# Altium project VTG-Ctrl.PrjPcb
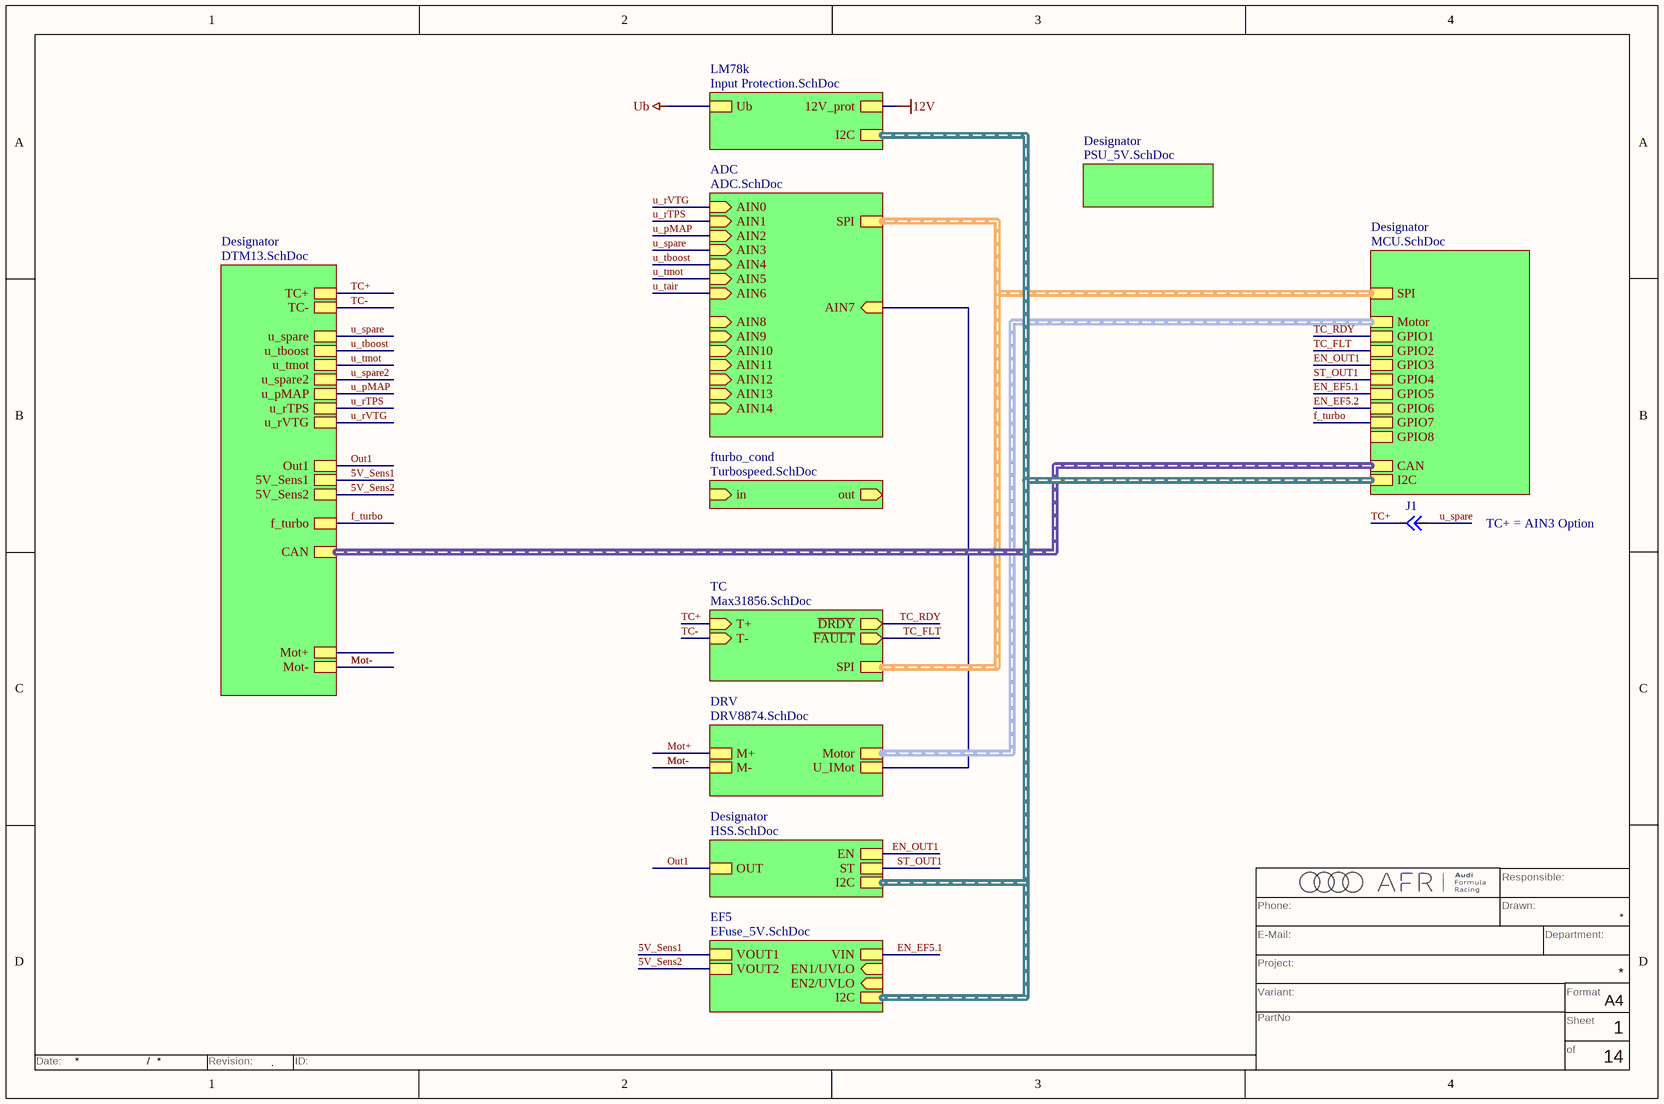
[diagram p0: VTG-Ctrl.SchDoc]
13 sheets, 162 parts. Net scope: hierarchical (ports join the sheet entries above them; power ports are global).
Board file: VTG-Ctrl.PcbDoc
Sheets:
  VTG-Ctrl.SchDoc
    Designator = MCU.SchDoc
    TC = Max31856.SchDoc
    DRV = DRV8874.SchDoc
    ADC = ADC.SchDoc
      LPF0 = LPF.SchDoc
      LPF1 = LPF.SchDoc
      LPF2 = LPF.SchDoc
      LPF3 = LPF.SchDoc
      LPF4 = LPF.SchDoc
      LPF5 = LPF.SchDoc
      LPF6 = LPF.SchDoc
      LPF7 = LPF.SchDoc
      LPF8 = LPF.SchDoc
      LPF9 = LPF.SchDoc
      LPF10 = LPF.SchDoc
      LPF11 = LPF.SchDoc
      LPF12 = LPF.SchDoc
      LPF13 = LPF.SchDoc
      LPF14 = LPF.SchDoc
    EF5 = EFuse_5V.SchDoc
    LM78k = Input Protection.SchDoc
    Designator = PSU_5V.SchDoc
    Designator = HSS.SchDoc
    Designator = DTM13.SchDoc
    fturbo_cond = Turbospeed.SchDoc
  EFuse_12V.SchDoc

## Sheet VTG-Ctrl.SchDoc
size A4; Author: Auth. Name; CompanyName: Audi Formula Racing GmbH; Organization: Audi Formula Racing GmbH; Address1: Heinrichsheimstr. 200; Address2: D-86633 Neuburg a.d. Donau; SheetNumber: 1; SheetTotal: 14

### Parts
J1  JUMPER  [JUMPER]  (value not drawn)

### Sub-sheets
ADC = ADC.SchDoc: AIN0 (in), AIN1 (in), AIN2 (in), AIN3 (in), AIN4 (in), AIN5 (in), AIN6 (in), AIN7 (in), SPI (harness SPI), AIN8 (in), AIN9 (in), AIN10 (in), AIN11 (in), AIN12 (in), AIN13 (in), AIN14 (in)
Designator = MCU.SchDoc: SPI (harness SPI), Motor (harness MotCtrl), GPIO1, GPIO2, GPIO3, GPIO4, GPIO5, CAN (harness CAN), GPIO6, GPIO7, GPIO8, I2C (harness I2C)
Designator = PSU_5V.SchDoc: no entries
Designator = HSS.SchDoc: ST, EN, OUT, I2C (harness I2C)
Designator = DTM13.SchDoc: TC+, TC-, u_spare, u_tboost, u_tmot, u_spare2, Out1, u_pMAP, u_rTPS, 5V_Sens1, 5V_Sens2, f_turbo, u_rVTG, Mot+, Mot-, CAN (harness CAN)
DRV = DRV8874.SchDoc: Motor (harness MotCtrl), U_IMot, M+, M-
EF5 = EFuse_5V.SchDoc: VIN, VOUT1, EN1/UVLO (in), EN2/UVLO (in), VOUT2, I2C (harness I2C)
fturbo_cond = Turbospeed.SchDoc: in (in), out (out)
LM78k = Input Protection.SchDoc: Ub, 12V_prot, I2C (harness I2C)
TC = Max31856.SchDoc: T- (in), T+ (in), ~{DRDY} (out), ~{FAULT} (out), SPI (harness SPI)

### Nets
5V_Sens1: sheet EF5/VOUT1, sheet Designator/5V_Sens1
5V_Sens2: sheet EF5/VOUT2, sheet Designator/5V_Sens2
AIN7: sheet DRV/U_IMot, sheet ADC/AIN7
EN_EF5.1: sheet Designator/GPIO5, sheet EF5/VIN
EN_EF5.2: sheet Designator/GPIO6
EN_OUT1: sheet Designator/GPIO3, sheet Designator/EN
f_turbo: sheet Designator/GPIO7, sheet Designator/f_turbo
Mot-: sheet DRV/M-, sheet Designator/Mot-
Out1: sheet Designator/OUT, sheet Designator/Out1
ST_OUT1: sheet Designator/GPIO4, sheet Designator/ST
TC+: J1.1 ; sheet TC/T+, sheet Designator/TC+
TC-: sheet TC/T-, sheet Designator/TC-
TC_FLT: sheet Designator/GPIO2, sheet TC/~{FAULT}
TC_RDY: sheet Designator/GPIO1, sheet TC/~{DRDY}
u_pMAP: sheet ADC/AIN2, sheet Designator/u_pMAP
u_rTPS: sheet ADC/AIN1, sheet Designator/u_rTPS
u_rVTG: sheet ADC/AIN0, sheet Designator/u_rVTG
u_spare: J1.2 ; sheet ADC/AIN3, sheet Designator/u_spare
u_spare2: sheet Designator/u_spare2
u_tboost: sheet ADC/AIN4, sheet Designator/u_tboost
u_tmot: sheet ADC/AIN5, sheet Designator/u_tmot

### Buses and harness runs
harness sheet ADC/SPI = sheet Designator/SPI = sheet TC/SPI
harness sheet Designator/I2C = sheet EF5/I2C = sheet LM78k/I2C
harness sheet Designator/Motor = sheet DRV/Motor

### Notes on the sheet
- TC+ = AIN3 Option
- Phone:
- Responsible:
- Drawn:
- Variant:
- Project:
- E-Mail:
- Department:
- Format
- PartNo
- of
- Sheet
- A4
- Date:
- /
- Revision:
- .
- ID:

### Library data of the parts
J1 = CMP-009-00061-4: Pins: 2

## Sheet MCU.SchDoc
size A4; SheetNumber: 2; SheetTotal: 14
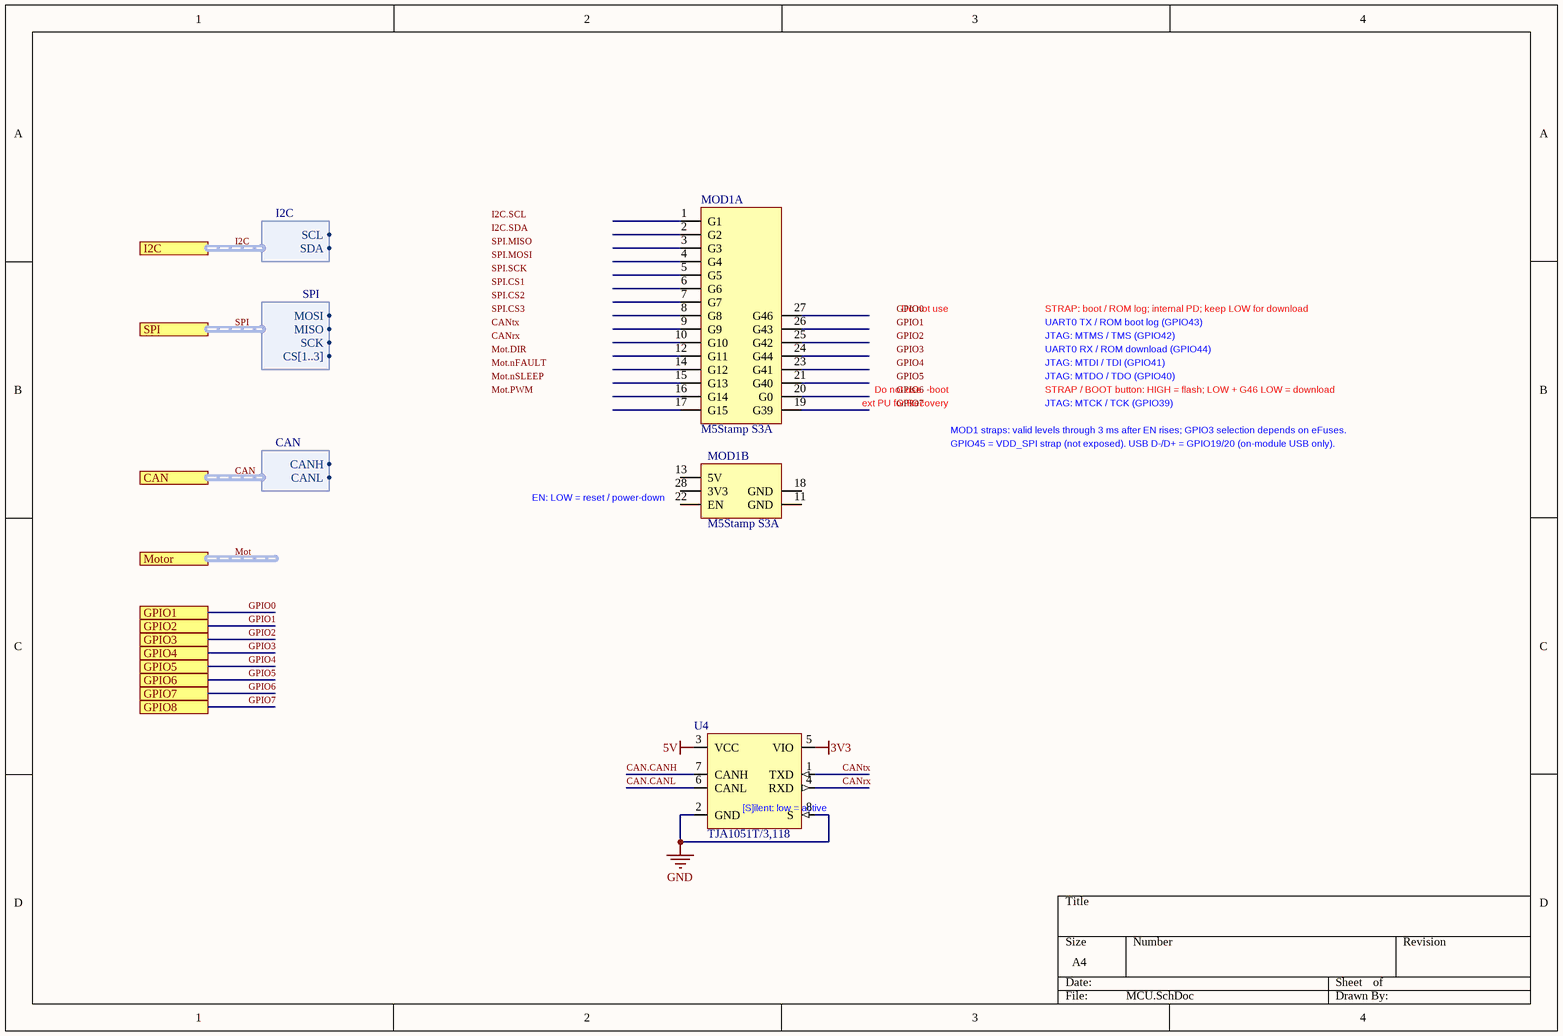
[diagram p1: MCU.SchDoc]

### Parts
MOD1  M5Stamp S3A  [M5Stamp S3A-mfg]  (parts A,B of 2)
U4  TJA1051T/3,118  [NXP-SOIC-8_L]

### Ports
CAN (harness CAN), GPIO1, GPIO2, GPIO3, GPIO4, GPIO5, GPIO6, GPIO7, GPIO8, I2C (harness I2C), Motor (harness MotCtrl), SPI (harness SPI)

### Harnesses
SPI: MOSI, MISO, SCK, CS[1..3]
CAN: CANH, CANL
I2C: SCL, SDA

### Nets
3V3: U4.5(VIO)
5V: U4.3(VCC)
GND: U4.2(GND) U4.8(S)
CAN.CANH: U4.7(CANH)
CAN.CANL: U4.6(CANL)
CANrx: U4.4(RXD)
CANtx: U4.1(TXD)
GPIO5: port GPIO6  [project net EN_EF5.2]
GPIO7: port GPIO8

Not connected (* = marked no-connect by the designer): MOD1 1(G1) 2(G2) 3(G3) 4(G4) 5(G5) 6(G6) 7(G7) 8(G8) 9(G9) 10(G10) 11(GND) 12(G11) 13(5V) 14(G12) 15(G13) 16(G14) 17(G15) 18(GND) 19(G39) 20(G0) 21(G40) 22(EN) 23(G41) 24(G44) 25(G42) 26(G43) 27(G46) 28(3V3)

### Buses and harness runs
harness CAN = port CAN
harness I2C = port I2C
harness Mot = port Motor
harness SPI = port SPI

### Notes on the sheet
- Do not use
- STRAP: boot / ROM log; internal PD; keep LOW for download
- JTAG: MTDO / TDO (GPIO40)
- JTAG: MTDI / TDI (GPIO41)
- JTAG: MTMS / TMS (GPIO42)
- UART0 RX / ROM download (GPIO44)
- UART0 TX / ROM boot log (GPIO43)
- Do not use  -boot
- ext PU for Recovery
- MOD1 straps: valid levels through 3 ms after EN rises; GPIO3 selection depends on eFuses.
- GPIO45 = VDD_SPI strap (not exposed). USB D-/D+ = GPIO19/20 (on-module USB only).
- STRAP / BOOT button: HIGH = flash; LOW + G46 LOW = download
- JTAG: MTCK / TCK (GPIO39)
- (near MOD1) EN: LOW = reset / power-down
- (near U4) [S]ilent: low = active
- Labels drawn without touching a wire or pin: CANrx, CANtx, GPIO0, GPIO1, GPIO2, GPIO3, GPIO4, GPIO5, GPIO6, GPIO7, I2C.SCL, I2C.SDA, Mot.DIR, Mot.nFAULT, Mot.nSLEEP, Mot.PWM, SPI.CS1, SPI.CS2, SPI.CS3, SPI.MISO, SPI.MOSI, SPI.SCK

### Library data of the parts
MOD1 = CMP-00060AA.R2: ESP32-S3FN8, 8MB Flash, RGB LED; Processor: ESP32-S3FN8; ComponentLink1Description: Product Page; ComponentLink1URL: https://docs.m5stack.com/en/core/Stamp-S3A
U4 = CMP-031-00023-A02: Interface Circuit, 1-Trnsvr, PDSO8; Data Rate: 1000Mbps; Number of Transceivers: 1; Power Supplies: 5V; Qualification Status: Not Qualified; Max Supply Current: 70uA; Package Body Material: Plastic; Telecom IC Type: CAN TRANSCEIVER; Package Equivalence Code: SOP8,.25; Reach SVHC Compliant: Yes; Width: 3.9mm; Terminal Position: DUAL; Channels: 1; Temperature Grade: AUTOMOTIVE; JESD-30 Code: R-PDSO-G8; Moisture Sensitivity Level: 1; Max Operating Temperature: 125°C; Terminal Pitch: 1.27mm; Case/Package: SOP; Terminal Form: Gull Wing; Pins: 8; Min Operating Temperature: -40°C; Terminal Finish: Nickel; Height - Seated (Max): 1.75mm; Package Style: SMALL OUTLINEMeter; Nominal Supply Voltage: 5V; RoHS Compliant: Yes; Surface Mount: Yes; Package Shape: Rectangular; JESD-609 Code: e4; Length: 4.9mm

## Sheet Max31856.SchDoc
size A4; SheetNumber: 3; SheetTotal: 7
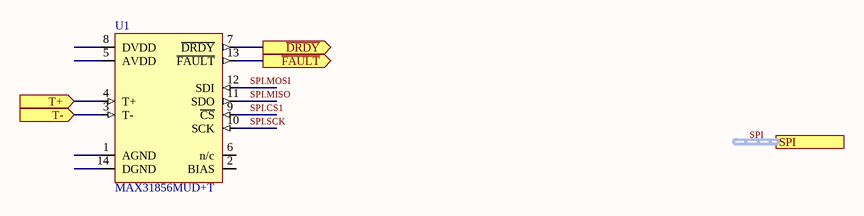
[diagram p2: Max31856.SchDoc]

### Parts
U1  MAX31856MUD+T  [TSSOP - 14]

### Ports
SPI (harness SPI), T+ (in), T- (in), ~{DRDY} (out), ~{FAULT} (out)

### Nets
SPI.CS1: U1.9(~{CS})
SPI.MISO: U1.11(SDO)
SPI.MOSI: U1.12(SDI)
SPI.SCK: U1.10(SCK)
TC+: U1.4(T+) ; port T+
TC-: U1.3(T-) ; port T-
TC_FLT: U1.13(~{FAULT}) ; port ~{FAULT}
TC_RDY: U1.7(~{DRDY}) ; port ~{DRDY}

Not connected (* = marked no-connect by the designer): U1 1(AGND) 2(BIAS) 5(AVDD) 6(n/c) 8(DVDD) 14(DGND)

### Buses and harness runs
harness SPI = port SPI

### Library data of the parts
U1 = CMP-015-00035-A01: Sensor Interface Precision Thermocouple to Digital Converter with Linearization; Samples Frequency: 10Hz; Sample Resolution: 19; Interface: SPI; Signal Type: Differential; Supply Voltage (Max): 3.6V; Supply Voltage (Min): 3.3V; Operating Temperature (Max): 125°C; Mounting Technology: Surface Mount; Pins: 14; RoHS Compliant: Yes; Operating Temperature (Min): -55°C; Case/Package: TSSOP

## Sheet DRV8874.SchDoc
size A4; SheetNumber: 4; SheetTotal: 7
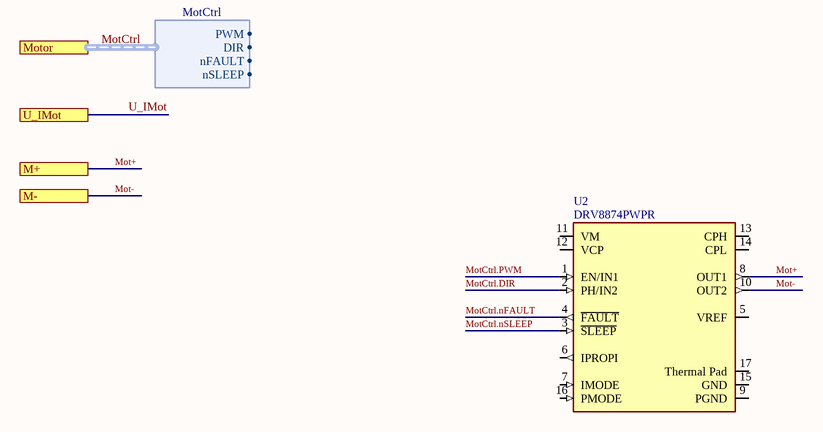
[diagram p3: DRV8874.SchDoc]

### Parts
U2  DRV8874PWPR  [FP-PWP0016J-MFG]

### Ports
M+, M-, Motor (harness MotCtrl), U_IMot

### Harnesses
MotCtrl: PWM, DIR, nFAULT, nSLEEP

### Nets
Mot+: U2.8(OUT1) ; port M+
Mot-: U2.10(OUT2) ; port M-
MotCtrl.DIR: U2.2(PH/IN2)
MotCtrl.nFAULT: U2.4(~{FAULT})
MotCtrl.nSLEEP: U2.3(~{SLEEP})
MotCtrl.PWM: U2.1(EN/IN1)

Not connected (* = marked no-connect by the designer): U2 5(VREF) 6(IPROPI) 7(IMODE) 9(PGND) 11(VM) 12(VCP) 13(CPH) 14(CPL) 15(GND) 16(PMODE) 17(Thermal_Pad)

### Buses and harness runs
harness MotCtrl = port Motor

### Library data of the parts
U2 = CMP-00024-00019-A02: 40-V, 6-A H-bridge motor driver with integrated current sensing feedback 16-HTSSOP -40 to 125; Sink Current (Max): -6A; Working Voltage: 5V; Supply Voltage (Max): 37V; Supply Voltage (Min): 4.5V; Source Current (Max): 6A; Operating Temperature (Max): 125°C; Pins: 16; Mounting Technology: SMT; Operating Temperature (Min): -40°C; RoHS Compliant: 16; Case/Package: HTSSOP16

## Sheet ADC.SchDoc
size A4; SheetNumber: 5; SheetTotal: 14
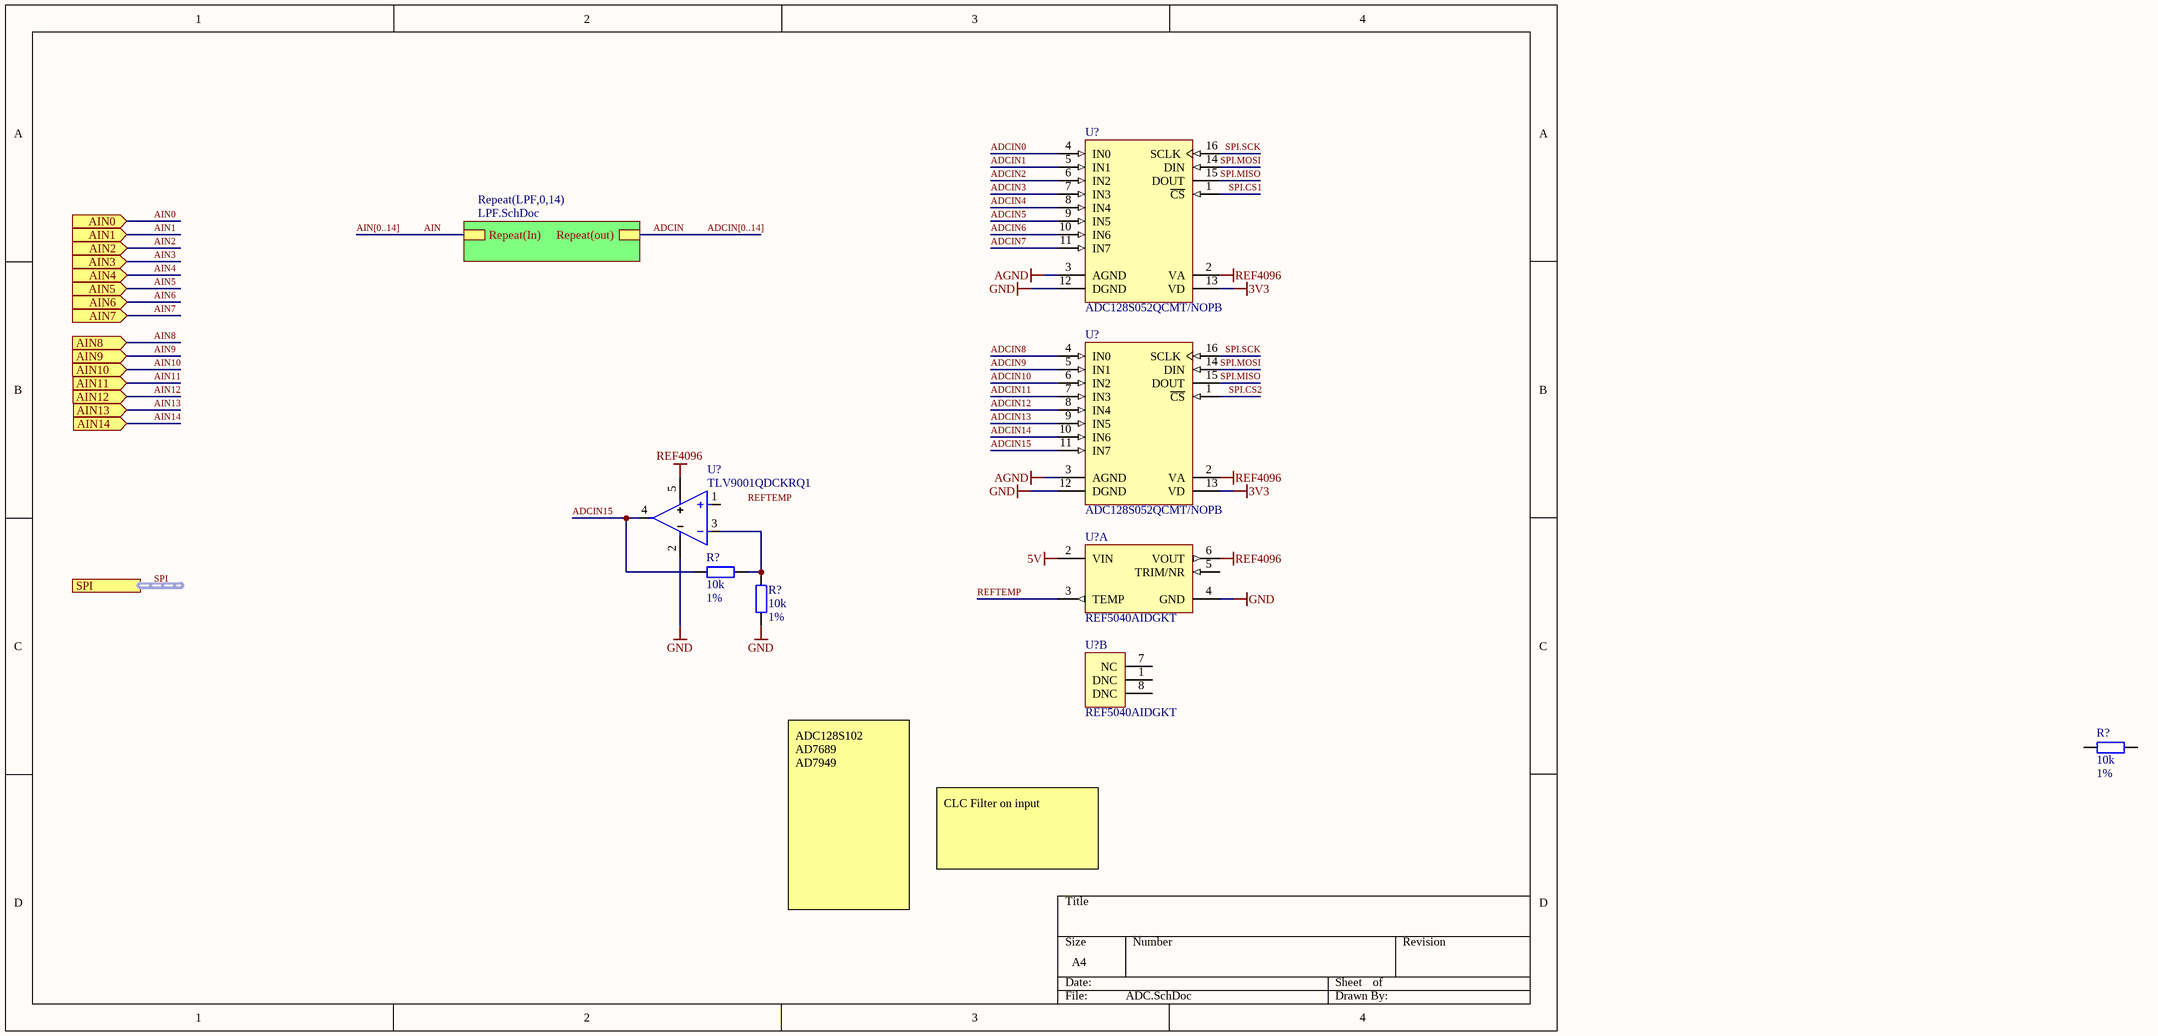
[diagram p4: ADC.SchDoc]

### Parts
(Parts that share a designator on the sheet are numbered #1, #2 ... from top to bottom, then left to right.)
R?#1  value 10k  Tolerance: 1%  [SMD_0603_RES]  (hidden comment: ERJ-3EKF1002V)
R?#2  value 10k  Tolerance: 1%  [SMD_0603_RES]  (hidden comment: ERJ-3EKF1002V)
R?#3  value 10k  Tolerance: 1%  [SMD_0603_RES]  (hidden comment: ERJ-3EKF1002V)
U?#1  ADC128S052QCMT/NOPB  [TI-PW16_L]
U?#2  ADC128S052QCMT/NOPB  [TI-PW16_L]
U?#3  TLV9001QDCKRQ1  [FP-DCK0005A-MFG]
U?#4  REF5040AIDGKT  [DGK0008A_N]  (part A of 2)
U?#5  REF5040AIDGKT  [DGK0008A_N]  (part B of 2)

### Sub-sheets
Repeat(LPF,0,14) = LPF.SchDoc: Repeat(In), Repeat(out)

### Ports
AIN0 (in), AIN1 (in), AIN2 (in), AIN3 (in), AIN4 (in), AIN5 (in), AIN6 (in), AIN7 (in), AIN8 (in), AIN9 (in), AIN10 (in), AIN11 (in), AIN12 (in), AIN13 (in), AIN14 (in), SPI (harness SPI)

### Nets
3V3: U?#1.13(VD) U?#2.13(VD)
5V: U?#4.2(VIN)
AGND: U?#1.3(AGND) U?#2.3(AGND)
GND: R?#2.1 U?#1.12(DGND) U?#2.12(DGND) U?#3.2(V-) U?#4.4(GND)
REF4096: U?#1.2(VA) U?#2.2(VA) U?#3.5(V+) U?#4.6(VOUT)
ADCIN: sheet Repeat(LPF,0,14)/Repeat(out)
ADCIN0: U?#1.4(IN0)
ADCIN1: U?#1.5(IN1)
ADCIN2: U?#1.6(IN2)
ADCIN3: U?#1.7(IN3)
ADCIN4: U?#1.8(IN4)
ADCIN5: U?#1.9(IN5)
ADCIN6: U?#1.10(IN6)
ADCIN7: U?#1.11(IN7)
ADCIN8: U?#2.4(IN0)
ADCIN9: U?#2.5(IN1)
ADCIN10: U?#2.6(IN2)
ADCIN11: U?#2.7(IN3)
ADCIN12: U?#2.8(IN4)
ADCIN13: U?#2.9(IN5)
ADCIN14: U?#2.10(IN6)
ADCIN15: R?#1.1 U?#2.11(IN7) U?#3.4(OUT)
AIN: sheet Repeat(LPF,0,14)/Repeat(In)
REFTEMP: U?#4.3(TEMP)
SPI.CS1: U?#1.1(~{CS})
SPI.CS2: U?#2.1(~{CS})
SPI.MISO: U?#1.15(DOUT) U?#2.15(DOUT)
SPI.MOSI: U?#1.14(DIN) U?#2.14(DIN)
SPI.SCK: U?#1.16(SCLK) U?#2.16(SCLK)
NetR?#1_2: R?#1.2 R?#2.2 U?#3.3(-IN)

Not connected (* = marked no-connect by the designer): R?#3 1 2; U?#3 1(+IN); U?#4 5(TRIM/NR); U?#5 1(DNC) 7(NC) 8(DNC)

### Buses and harness runs
bus ADCIN[0..14]
bus AIN[0..14]
harness SPI = port SPI

### Notes on the sheet
- ADC128S102
  AD7689
  AD7949
- CLC Filter on input
- Labels drawn without touching a wire or pin: REFTEMP

### Library data of the parts
R?#1-R?#3 = CMP-009-07799-A10: RES SMD 10K OHM 1% 1/10W 0603 ±100ppm/°C; Voltage Rating: 75V; Power: 100mW; Pins: 2; RoHS Compliant: Yes; Temperature Coefficient: ±100ppm/°C; Operating Temperature (Min): -55°C; Mounting Technology: SMT; Case/Package: 0603; Operating Temperature (Max): 125°C
U?#1 U?#2 = CMP-0054-00500-3: 8-Channel, 200 to 500 kSPS, 12-Bit ADC, -40 to 125 degC, 16-pin SOP (PW16), Green (RoHS & no Sb/Br); Manufacturer: Texas Instruments; Resolution(Bits): 12; Digital Supply(Max)(V): 5.25; SNR(dB): 73; INL(Max)(+/-LSB): 1; Analog Voltage AV/DD(Min)(V): 2.7; SFDR(dB): 92; Interface: Serial SPI, QSPI, Microwire (Serial I/O); # Input Channels: 8; ENOB(Bits): 11.8; SubFamily: Precision ADC (<=10MSPS); Architecture: SAR; Sample Rate(max)(SPS): 500k; PartNumber: ADC128S052QCMT/NOPB; PackageDescription: 16-Pin Plastic Small Outline, Body 5 x 4.4 mm, Pitch 0.65 mm; Analog Voltage AV/DD(Max)(V): 5.25; PackageReference: PW16; Digital Supply(Min)(V): 2.7; Code_JEDEC: MO-153; PackageVersion: 4040064-4/G, 02/2011; ComponentLink2URL: http://www.ti.com/lit/ds/symlink/adc128s052-q1.pdf; ComponentLink3URL: http://www.ti.com/lit/ml/mpds361/mpds361.pdf; Mounting Technology: Surface Mount; ComponentLink1URL: http://www.ti.com/; SINAD(dB): 73; ComponentLink2Description: Datasheet; ComponentLink3Description: Package Specification; Eco-Plan: Green (RoHS & no Sb/Br); ComponentLink1Description: Manufacturer URL; DatasheetVersion: SNAS333D
U?#3 = CMP-014-00003-6: Operational Amplifier, 1 Func, 1500uV Offset-Max, CMOS, PDSO5; Nominal Supply Voltage: 5V; Channels: 1; Min Supply Voltage: 1.8V; Max Supply Voltage: 5.5V; Frequency: 1MHz; Mounting Technology: SMT; Output Type: CMOS; Min Operating Temperature: -40°C; Case/Package: SOT-SC70; RoHS Compliant: Yes; Pins: 5; Max Operating Temperature: 125°C
U?#4 U?#5 = CMP-0367-00268-2: Low Noise, Very Low Drift, Precision Voltage Reference, -40 to 125 degC, 8-pin MSOP (DGK), Green (RoHS & no Sb/Br); Manufacturer: Texas Instruments; VI(Min)(V): 4.296; Iout/Iz(Max)(mA): 10; Initial Accuracy @ 25/deg C(%): 0.05; SubFamily: Series Voltage Reference; VO(V): 4.096; Rating: Catalog; Temp Coeff(Max)(ppm/ degree C): 3; Iq(Max)(uA): 1000; VI(Max)(V): 18; DatasheetVersion: SBOS410E; ComponentLink3URL: http://www.ti.com/litv/pdf/mpds028d; ComponentLink1Description: Manufacturer URL; Eco-Plan: Green (RoHS & no Sb/Br); PackageReference: DGK0008A; PartNumber: REF5040AIDGKT; ComponentLink2URL: http://www.ti.com/general/docs/lit/getliterature.tsp?genericPartNumber=REF5040&fileType=pdf; Mounting Technology: Surface Mount; Code_JEDEC: MO-187; ComponentLink3Description: Package Specification; PackageVersion: 4073329/E; ComponentLink1URL: http://www.ti.com/; PackageDescription: 8-Pin Thin Small Outline Package 3 x 3 mm Body ,0.65 mm Pitch; ComponentLink2Description: Datasheet

## Sheet LPF.SchDoc
size A4; SheetNumber: 6; SheetTotal: 14; SPICEModelCacheAYWLURAG: <root> / <DocumentId>AYWLURAG</DocumentId> / <CacheFrame Number="0"> / <Model Name="0603_885012206067_22nf" Kind="CKT"> / <Text>******* / .subckt 0603_885012206067_22nF 1 2 / Rser 1 3 0.03101 / Lser 2 4 0.00000000028048 / C1 3 4 0.000000022 / Rpar 3 4 10000000000 / .ends 0603_885012206067_22nF</Text> / </Model> / <Model Name="0603_885012206065_10nf" Kind="CKT"> / <Text>******* / .subckt 0603_885012206065_10nF 1 2 / Rser 1 3 0.05893 / Lser 2 4 0.00000000037916 / C1 3 4 0.00000001 / Rpar 3 4 10000000000 / .ends 0603_885012206065_10nF</Text> / </Model> / </CacheFrame> / </root>
Used 15 times, as channels ADC/LPF0, ADC/LPF1, ADC/LPF2, ADC/LPF3, ADC/LPF4, ADC/LPF5, ADC/LPF6, ADC/LPF7, ADC/LPF8, ADC/LPF9, ADC/LPF10, ADC/LPF11, ADC/LPF12, ADC/LPF13, ADC/LPF14. Parts and nets are listed once, with the designators drawn on the sheet.
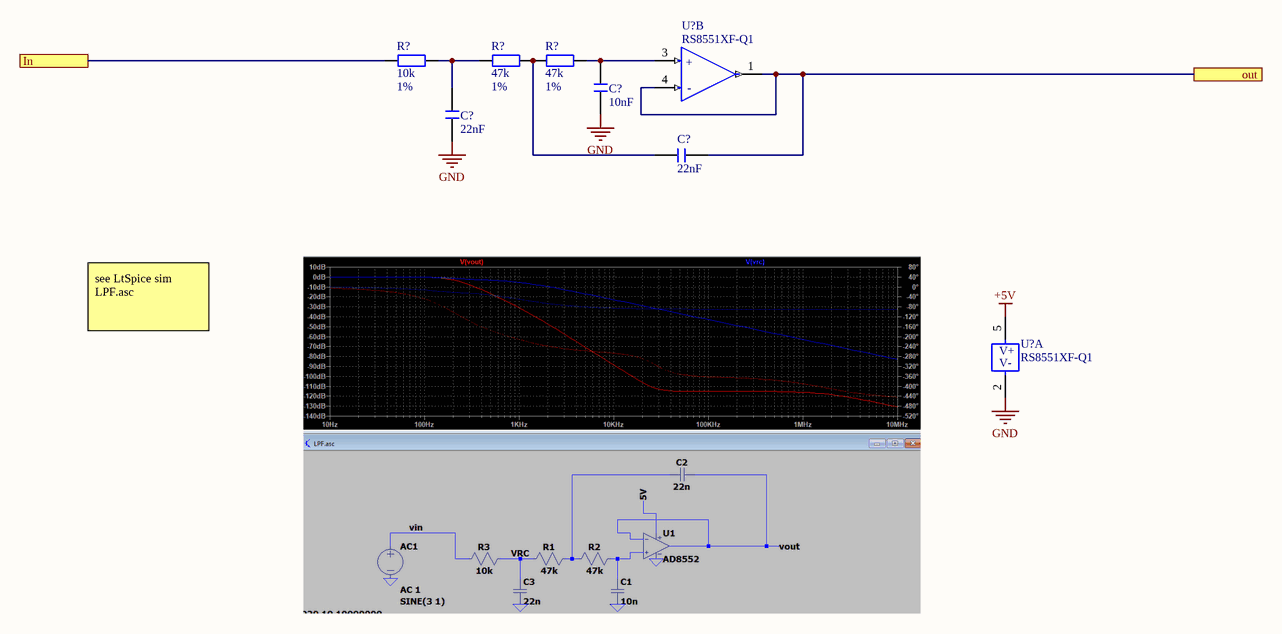
[diagram p5: LPF.SchDoc]

### Parts
(Parts that share a designator on the sheet are numbered #1, #2 ... from top to bottom, then left to right.)
C?#1  value 10nF  [WCAP-CSGP_0603_L1.6W0.8H0.8_Reflow]  (hidden comment: 885012206065)
C?#2  value 22nF  [WCAP-CSGP_0603_L1.6W0.8H0.8_Reflow]  (hidden comment: 885012206067)
C?#3  value 22nF  [WCAP-CSGP_0603_L1.6W0.8H0.8_Reflow]  (hidden comment: 885012206067)
R?#1  value 10k  Tolerance: 1%  [SMD_0603_RES]  (hidden comment: ERJ-3EKF1002V)
R?#2  value 47k  Tolerance: 1%  [SMD_0603_RES]  (hidden comment: ERJ-3EKF4702V)
R?#3  value 47k  Tolerance: 1%  [SMD_0603_RES]  (hidden comment: ERJ-3EKF4702V)
U?#1  RS8551XF-Q1  [TI-SOT23-5_DBV0005A]  (part B of 2)
U?#2  RS8551XF-Q1  [TI-SOT23-5_DBV0005A]  (part A of 2)

### Ports
In, out

### Nets
+5V: U?#2.5(V+)
GND: C?#1.1 C?#2.1 U?#2.2(V-)
In: R?#1.1 ; port In
out: C?#3.1 U?#1.1(OUT) U?#1.4(-IN) ; port out
NetC?#1_2: C?#1.2 R?#3.2 U?#1.3(+IN)
NetC?#2_2: C?#2.2 R?#1.2 R?#2.1
NetC?#3_2: C?#3.2 R?#2.2 R?#3.1

### Channels
ADC/LPF0: designators C?=C?_LPF15#2 C?=C?_LPF15#3 C?=C?_LPF15#1 R?=R?_LPF15#1 R?=R?_LPF15#2 R?=R?_LPF15#3 U?=U?_LPF15#2 U?=U?_LPF15#1; ports In=u_rVTG out=ADCIN0
ADC/LPF1: designators C?=C?_LPF1#2 C?=C?_LPF1#3 C?=C?_LPF1#1 R?=R?_LPF1#1 R?=R?_LPF1#2 R?=R?_LPF1#3 U?=U?_LPF1#2 U?=U?_LPF1#1; ports In=u_rTPS out=ADCIN1
ADC/LPF2: designators C?=C?_LPF2#2 C?=C?_LPF2#3 C?=C?_LPF2#1 R?=R?_LPF2#1 R?=R?_LPF2#2 R?=R?_LPF2#3 U?=U?_LPF2#2 U?=U?_LPF2#1; ports In=u_pMAP out=ADCIN2
ADC/LPF3: designators C?=C?_LPF3#2 C?=C?_LPF3#3 C?=C?_LPF3#1 R?=R?_LPF3#1 R?=R?_LPF3#2 R?=R?_LPF3#3 U?=U?_LPF3#2 U?=U?_LPF3#1; ports In=u_spare out=ADCIN3
ADC/LPF4: designators C?=C?_LPF4#2 C?=C?_LPF4#3 C?=C?_LPF4#1 R?=R?_LPF4#1 R?=R?_LPF4#2 R?=R?_LPF4#3 U?=U?_LPF4#2 U?=U?_LPF4#1; ports In=u_tboost out=ADCIN4
ADC/LPF5: designators C?=C?_LPF5#2 C?=C?_LPF5#3 C?=C?_LPF5#1 R?=R?_LPF5#1 R?=R?_LPF5#2 R?=R?_LPF5#3 U?=U?_LPF5#2 U?=U?_LPF5#1; ports In=u_tmot out=ADCIN5
ADC/LPF6: designators C?=C?_LPF6#2 C?=C?_LPF6#3 C?=C?_LPF6#1 R?=R?_LPF6#1 R?=R?_LPF6#2 R?=R?_LPF6#3 U?=U?_LPF6#2 U?=U?_LPF6#1; ports In=u_tair out=ADCIN6
ADC/LPF7: designators C?=C?_LPF7#2 C?=C?_LPF7#3 C?=C?_LPF7#1 R?=R?_LPF7#1 R?=R?_LPF7#2 R?=R?_LPF7#3 U?=U?_LPF7#2 U?=U?_LPF7#1; ports In=AIN7 out=ADCIN7
ADC/LPF8: designators C?=C?_LPF8#2 C?=C?_LPF8#3 C?=C?_LPF8#1 R?=R?_LPF8#1 R?=R?_LPF8#2 R?=R?_LPF8#3 U?=U?_LPF8#2 U?=U?_LPF8#1; ports In=AIN8 out=ADCIN8
ADC/LPF9: designators C?=C?_LPF9#2 C?=C?_LPF9#3 C?=C?_LPF9#1 R?=R?_LPF9#1 R?=R?_LPF9#2 R?=R?_LPF9#3 U?=U?_LPF9#2 U?=U?_LPF9#1; ports In=AIN9 out=ADCIN9
ADC/LPF10: designators C?=C?_LPF10#2 C?=C?_LPF10#3 C?=C?_LPF10#1 R?=R?_LPF10#1 R?=R?_LPF10#2 R?=R?_LPF10#3 U?=U?_LPF10#2 U?=U?_LPF10#1; ports In=AIN10 out=ADCIN10
ADC/LPF11: designators C?=C?_LPF11#2 C?=C?_LPF11#3 C?=C?_LPF11#1 R?=R?_LPF11#1 R?=R?_LPF11#2 R?=R?_LPF11#3 U?=U?_LPF11#2 U?=U?_LPF11#1; ports In=AIN11 out=ADCIN11
ADC/LPF12: designators C?=C?_LPF12#2 C?=C?_LPF12#3 C?=C?_LPF12#1 R?=R?_LPF12#1 R?=R?_LPF12#2 R?=R?_LPF12#3 U?=U?_LPF12#2 U?=U?_LPF12#1; ports In=AIN12 out=ADCIN12
ADC/LPF13: designators C?=C?_LPF13#2 C?=C?_LPF13#3 C?=C?_LPF13#1 R?=R?_LPF13#1 R?=R?_LPF13#2 R?=R?_LPF13#3 U?=U?_LPF13#2 U?=U?_LPF13#1; ports In=AIN13 out=ADCIN13
ADC/LPF14: designators C?=C?_LPF14#2 C?=C?_LPF14#3 C?=C?_LPF14#1 R?=R?_LPF14#1 R?=R?_LPF14#2 R?=R?_LPF14#3 U?=U?_LPF14#2 U?=U?_LPF14#1; ports In=AIN14 out=ADCIN14

### Notes on the sheet
- see LtSpice sim
  LPF.asc
- (in symbol CMP-014-00026-A01, part B) +; -

### Library data of the parts
C?#1 = CMP-001-00736-4: WCAP-CSGP Multilayer Ceramic Chip Capacitor, General Purpose, size 0603, X7R, 10nF, 25VDC; Manufacturer: Wurth Elektronik; Capacitance Tolerance: +/-10%; Rated Voltage (DC): 25V; Technical Reference: X7R0603103K025DFCT10000; Insulation Resistance: 10GO; Dissipation Factor: 3.5%; ComponentLink1Description: Website Link; Category: Multilayer Ceramic Chip Capacitors; Component Type: Standard; Operating Temperature Min: -55°C; Operating Temperature Max: 125°C; Height: 0.8mm; Case/Package: 0603; Ceramic Type: X7R; ComponentLink2Description: Datasheet Link; Mount: Surface Mount; Pins: 2; Match Code: WCAP-CSGP; Manufacturer Part Number: 885012206065; ComponentLink1URL: https://www.we-online.com/redexpert/article/885012206065?ad; Length: 1.6mm; ComponentLink2URL: https://www.we-online.com/redexpert/spec/885012206065?ad; Width: 0.8mm; Design Item ID: 885012206065; Packaging: Tape and Reel; Source: WCAP-CSGP.SchLib
C?#2 C?#3 = CMP-001-00738-4: WCAP-CSGP Multilayer Ceramic Chip Capacitor, General Purpose, size 0603, X7R, 22nF, 25VDC; Manufacturer: Wurth Elektronik; Capacitance Tolerance: +/-10%; Dissipation Factor: 3.5%; Technical Reference: X7R0603223K025DFCT10000; Rated Voltage (DC): 25V; Insulation Resistance: 10GO; Operating Temperature Min: -55°C; ComponentLink2Description: Datasheet Link; ComponentLink2URL: https://www.we-online.com/redexpert/spec/885012206067?ad; Design Item ID: 885012206067; Operating Temperature Max: 125°C; ComponentLink1URL: https://www.we-online.com/redexpert/article/885012206067?ad; Manufacturer Part Number: 885012206067; Width: 0.8mm; Height: 0.8mm; Pins: 2; Mount: Surface Mount; Case/Package: 0603; Length: 1.6mm; ComponentLink1Description: Website Link; Component Type: Standard; Ceramic Type: X7R; Packaging: Tape and Reel; Match Code: WCAP-CSGP; Source: WCAP-CSGP.SchLib; Category: Multilayer Ceramic Chip Capacitors
R?#1 = CMP-009-07799-A10: as R?#1 on sheet ADC; Pins: 2; RoHS Compliant: Yes; Temperature Coefficient: ±100ppm/°C; Operating Temperature (Min): -55°C; Mounting Technology: SMT; Case/Package: 0603; Operating Temperature (Max): 125°C
R?#2 R?#3 = CMP-009-08189-A11: RES SMD 47K OHM 1% 1/10W 0603 ±100ppm/°C; Voltage Rating: 75V; Power: 100mW; RoHS Compliant: Yes; Operating Temperature (Min): -55°C; Temperature Coefficient: ±100ppm/°C; Pins: 2; Case/Package: 0603; Operating Temperature (Max): 125°C; Mounting Technology: SMT
U?#1 U?#2 = CMP-014-00026-A01: Supply Voltage (Min): 2.7V; Channels: 1; Nominal Gain Bandwidth Product: 4.3Hz; Supply Voltage (Max): 5.5V; Output Type: R2R; Supply Voltage (Nom): 5V; Frequency: 4.3MHz; Case/Package: SOT23-5; Operating Temperature (Max): 125°C; Operating Temperature (Min): -40°C; RoHS Compliant: Yes; Mounting Technology: SMT; Pins: 5

## Sheet EFuse_5V.SchDoc
size A4; SheetNumber: 7; SheetTotal: 13
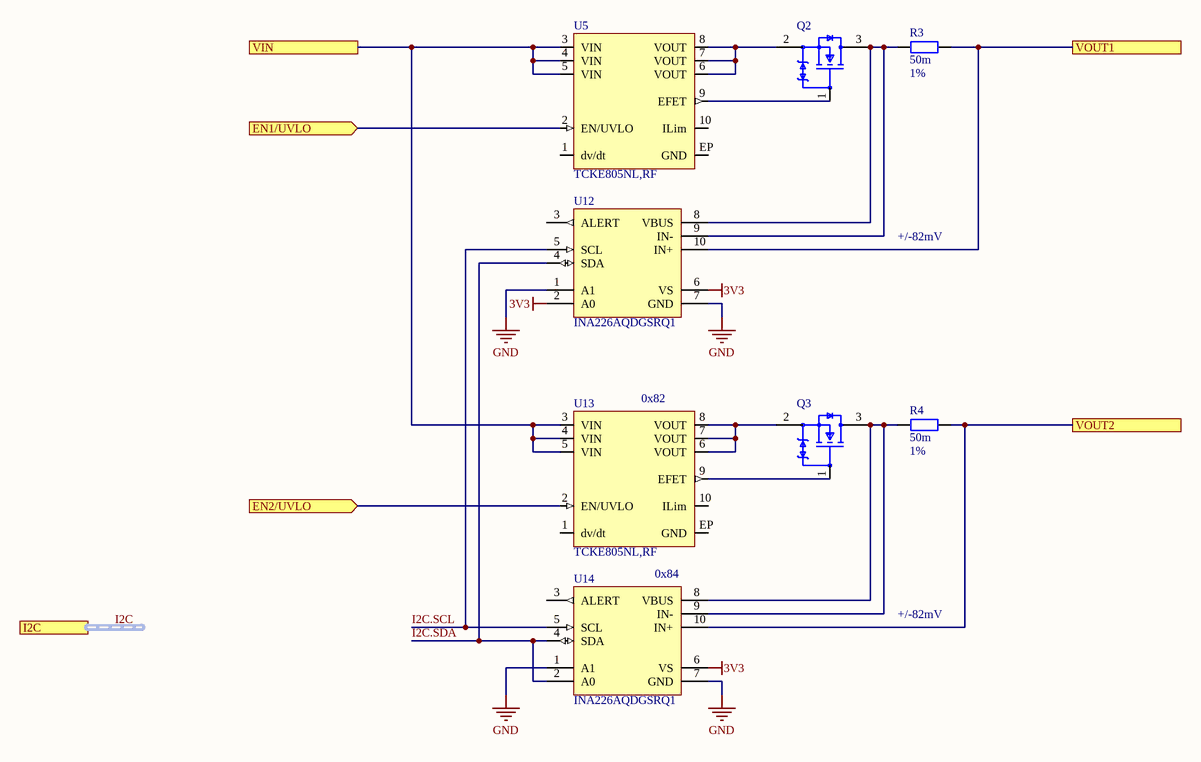
[diagram p6: EFuse_5V.SchDoc]

### Parts
Q2  DMG2302UK-7  [SOT23-3-DIODES]  (value not drawn)
Q3  DMG2302UK-7  [SOT23-3-DIODES]  (value not drawn)
R3  value 50m  Tolerance: 1%  [SMD_1206_RES]  (hidden comment: ERJ-8BWFR050V)
R4  value 50m  Tolerance: 1%  [SMD_1206_RES]  (hidden comment: ERJ-8BWFR050V)
U5  TCKE805NL,RF  [WSON10B-Toshiba]
U12  INA226AQDGSRQ1  [TI-DGS0010A-VSSOP-10]
U13  TCKE805NL,RF  [WSON10B-Toshiba]
U14  INA226AQDGSRQ1  [TI-DGS0010A-VSSOP-10]

### Ports
EN1/UVLO (in), EN2/UVLO (in), I2C (harness I2C), VIN, VOUT1, VOUT2

### Nets
3V3: U12.2(A0) U12.6(VS) U14.6(VS)
GND: U12.1(A1) U12.7(GND) U14.1(A1) U14.7(GND)
5V_Sens1: R3.2 U12.10(IN+) ; port VOUT1
5V_Sens2: R4.2 U14.10(IN+) ; port VOUT2
EN_EF5.1: U5.3(VIN) U5.4(VIN) U5.5(VIN) U13.3(VIN) U13.4(VIN) U13.5(VIN) ; port VIN
I2C.SCL: U12.5(SCL) U14.5(SCL)
I2C.SDA: U12.4(SDA) U14.2(A0) U14.4(SDA)
NetQ2_1: Q2.1(G) U5.9(EFET)
NetQ2_2: Q2.2(S) U5.6(VOUT) U5.7(VOUT) U5.8(VOUT)
NetQ2_3: Q2.3(D) R3.1 U12.8(VBUS) U12.9(IN-)
NetQ3_1: Q3.1(G) U13.9(EFET)
NetQ3_2: Q3.2(S) U13.6(VOUT) U13.7(VOUT) U13.8(VOUT)
NetQ3_3: Q3.3(D) R4.1 U14.8(VBUS) U14.9(IN-)
NetU5_2: U5.2(EN/UVLO) ; port EN1/UVLO
NetU13_2: U13.2(EN/UVLO) ; port EN2/UVLO

Not connected (* = marked no-connect by the designer): U5 1(dv/dt) 10(ILim) EP(GND); U12 3(ALERT); U13 1(dv/dt) 10(ILim) EP(GND); U14 3(ALERT)

### Buses and harness runs
harness I2C = port I2C

### Notes on the sheet
- +/-82mV
- (near U13) 0x82
- 0x84

### Library data of the parts
Q2 Q3 = CMP-013-00040-A01: Transistor: N-MOSFET; unipolar; 20V; 2.2A; 0, 09ohm; 0.66W; -55+150 st.C; SMD; SOT23; Drain current: 2.8A; Nominal Vgs: 4.5V; Transistor Type: NFET; Vgs (Max): 12V; Case/Package: TO-236-3; Mounting Technology: Surface Mount; RoHS Compliant: Yes; Pins: 3; Operating Temperature (Max): 150°C; Operating Temperature (Min): -55°C; Vds (Max): 20V
R3 R4 = CMP-009-10467-A07: RES SMD 0.05 OHM 1% 1 1206 ±100ppm/°C; Power: 1W; Voltage Rating: 200V; Operating Temperature (Max): 125°C; Case/Package: 1206; Temperature Coefficient: ±100ppm/°C; RoHS Compliant: Yes; Operating Temperature (Min): -55°C; Pins: 2; Mounting Technology: SMT
U5 U13 = CMP-00024-00021-A01: Hot-Swap Ctrl, Wson-10, -40 To 85Deg C Rohs Compliant: Yes; Supply Voltage (Min): 4.4V; Supply Voltage (Max): 18V; Source Current (Max): 5A; Case/Package: WSON10; Mounting Technology: SMT; Operating Temperature (Min): -55°C; Pins: 10; Operating Temperature (Max): 150°C; RoHS Compliant: Yes
U12 U14 = CMP-015-00037-A01: SP Amp Current Shunt and Power Monitor Dual 5.5V 10-Pin VSSOP T/R; Interface: I2C; Samples Frequency: 500kHz; Sample Resolution: 16; Supply Voltage (Min): 2.7V; Signal Type: Differential; Operating Temperature (Min): -40°C; Case/Package: VSSOP; Pins: 10; Supply Voltage (Max): 5.5V; Operating Temperature (Max): 125°C; RoHS Compliant: Yes; Mounting Technology: Surface Mount

## Sheet Input Protection.SchDoc
size A4; SheetNumber: 8; SheetTotal: 14
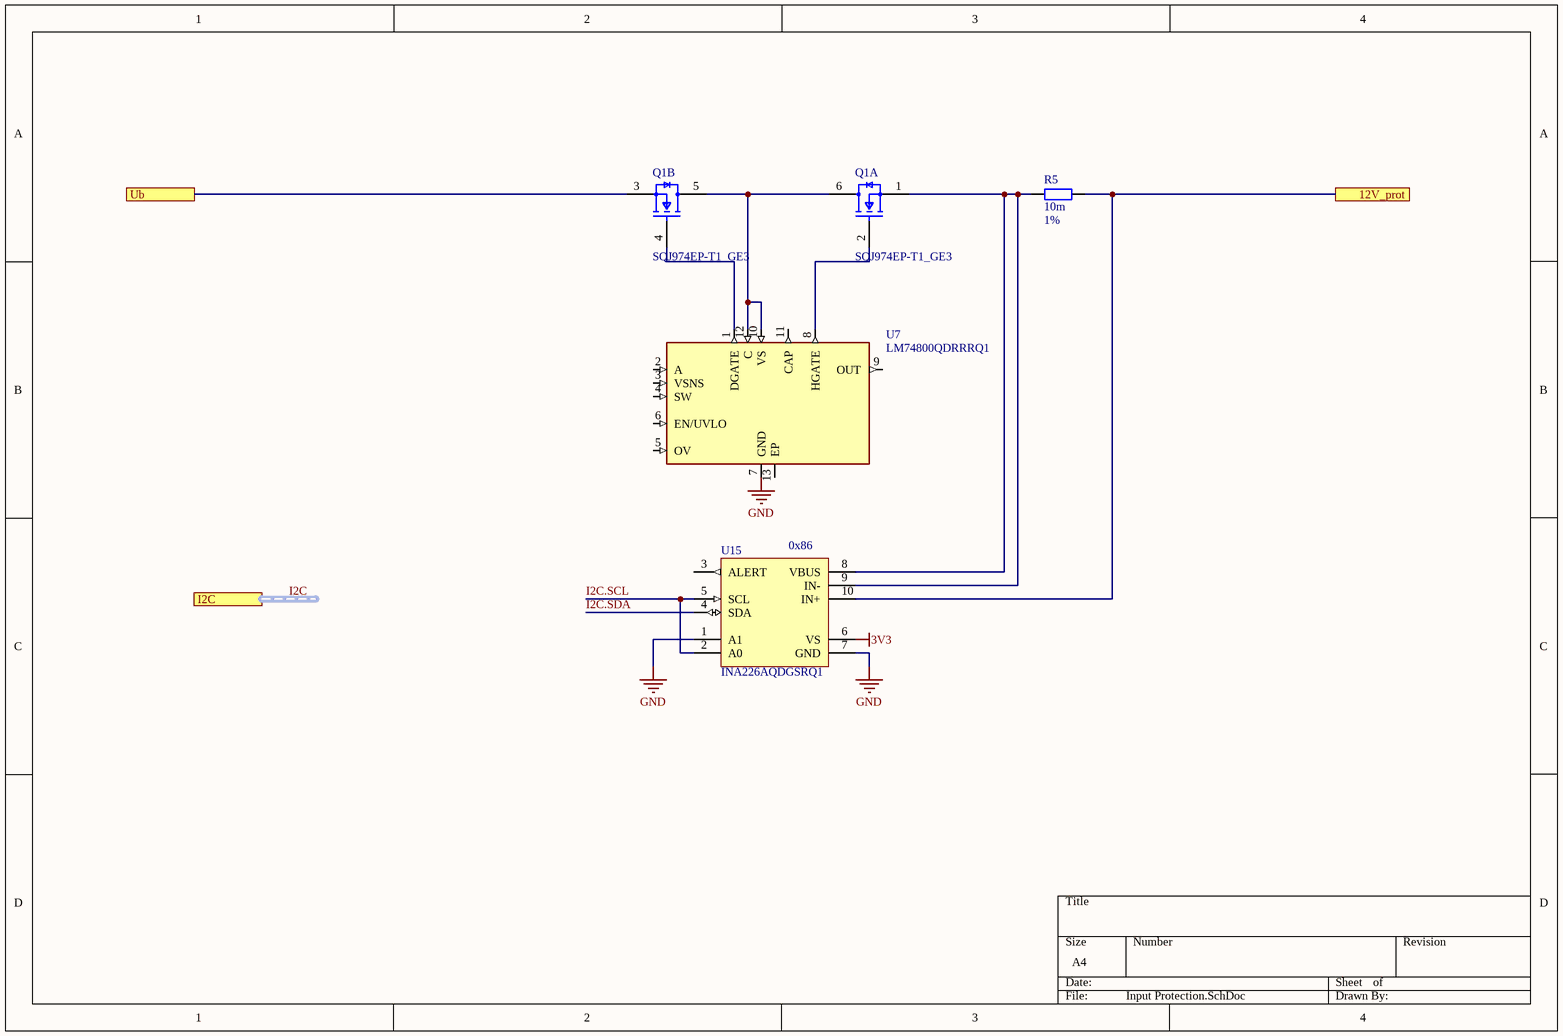
[diagram p7: Input Protection.SchDoc]

### Parts
Q1  SQJ974EP-T1_GE3  [FP-C21-1498-DUAL-MFG]  (parts A,B of 2)
R5  value 10m  Tolerance: 1%  [SMD_1206_RES]  (hidden comment: ERJ-8BWFR010V)
U7  LM74800QDRRRQ1  [FP-DRR0012E-IPC_B]
U15  INA226AQDGSRQ1  [TI-DGS0010A-VSSOP-10]

### Ports
12V_prot, I2C (harness I2C), Ub

### Nets
3V3: U15.6(VS)
12V: R5.2 U15.10(IN+) ; port 12V_prot
GND: U7.7(GND) U15.1(A1) U15.7(GND)
Ub: Q1.3(S2) ; port Ub
I2C.SCL: U15.2(A0) U15.5(SCL)
I2C.SDA: U15.4(SDA)
NetQ1_1: Q1.1(S1) R5.1 U15.8(VBUS) U15.9(IN-)
NetQ1_2: Q1.2(G1) U7.8(HGATE)
NetQ1_4: Q1.4(G2) U7.1(DGATE)
NetQ1_5: Q1.5(D2) Q1.6(D1) U7.10(VS) U7.12(C)

Not connected (* = marked no-connect by the designer): U7 2(A) 3(VSNS) 4(SW) 5(OV) 6(EN/UVLO) 9(OUT) 11(CAP) 13(EP); U15 3(ALERT)

### Buses and harness runs
harness I2C = port I2C

### Notes on the sheet
- (near U15) 0x86

### Library data of the parts
Q1 = CMP-013-00038-A01: Mosfet, N-Ch, 100V, 30A, 175Deg C, 48W Rohs Compliant: Yes; Nominal Vgs: 4V; Vgs (Max): 10V; Transistor Type: Dual NFET; Operating Temperature (Max): 175°C; RoHS Compliant: Yes; Case/Package: SO8; Vds (Max): 100V; Drain current: 30A; Mounting Technology: SMT; Operating Temperature (Min): -55°C; Pins: 6
R5 = CMP-009-10450-A07: RES SMD 0.01 OHM 1% 1 1206 ±200ppm/°C; Power: 1W; Voltage Rating: 200V; Operating Temperature (Max): 125°C; Temperature Coefficient: ±200ppm/°C; Case/Package: 1206; Pins: 2; Mounting Technology: SMT; Operating Temperature (Min): -55°C; RoHS Compliant: Yes
U7 = CMP-019-00082-A01: AUTOMOTIVE IDEAL DIODE CONTROLLE OR Controller N+1 ORing Controller N-Channel 1: 1 12-WSON (3x3); Manufacturer Lifecycle Status: ACTIVE; Input Voltage (Min): 3V; Enable: yes; Number of Outputs: 1; Input Voltage (Max): 65V; Max Junction Temperature (Tj): 150°C; Pins: 12; Case/Package: WSON12; Operating Temperature (Max): 125°C; Width: 3mm; Thickness: 750µm; Operating Temperature (Min): -40°C; Height: 800µm; Length: 3mm; RoHS: Compliant
U15 = CMP-015-00037-A01: as U12 on sheet EFuse_5V; Operating Temperature (Min): -40°C; Case/Package: VSSOP; Pins: 10; Supply Voltage (Max): 5.5V; Operating Temperature (Max): 125°C; RoHS Compliant: Yes; Mounting Technology: Surface Mount

## Sheet PSU_5V.SchDoc
size A4; SheetNumber: 9; SheetTotal: 12
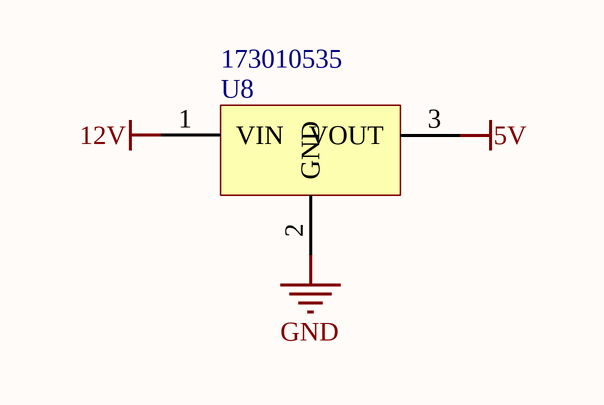
[diagram p8: PSU_5V.SchDoc]

### Parts
U8  173010535  [WPME-FDSM_SIP-3_L11.6W8H10.4]

### Nets
5V: U8.3(VOUT)
12V: U8.1(VIN)
GND: U8.2(GND)

### Library data of the parts
U8 = CMP-019-00019-A05: WPME-FDSM Fixed Step Down Regulator Module, THT, SIP-3, 8-36Vin, 5Vout, 1Aout; Output Current (Continuous): 1A; Input Voltage (Min): 8V; Input Voltage (Max): 36V; Output Voltage (Max): 5V; Component Type: Standard; Height: 10.4mm; Source: WPME-FDSM.SchLib; ComponentLink2URL: https://www.we-online.com/redexpert/spec/173010535?ad; Width: 8mm; Packaging: Tube; Operating Temperature (Min): -40°C; ComponentLink1URL: https://www.we-online.com/redexpert/article/173010535?ad; ComponentLink1Description: Website Link; ComponentLink2Description: Datasheet Link; Category: Step Down Converter; Operating Temperature (Max): 85°C; Pins: 3; Design Item ID: 173010535; Mount: Through Hole; Length: 11.6mm; Match Code: WPME-FDSM; Case/Package: SIP-3

## Sheet HSS.SchDoc
size A4; SheetNumber: 10; SheetTotal: 13
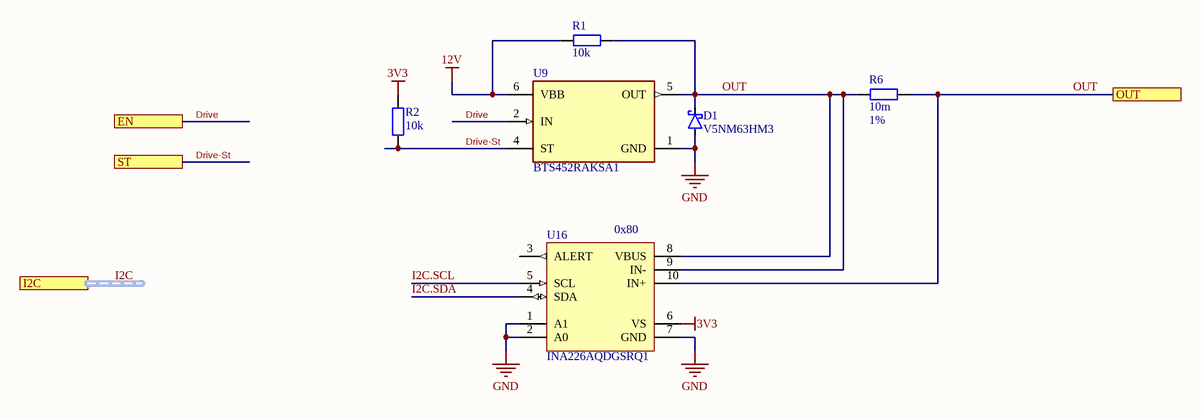
[diagram p9: HSS.SchDoc]

### Parts
D1  V5NM63HM3  [DFN3820A]
R1  value 10k  [SMD_0603_RES]  (hidden comment: ERJ-3EKF1002V)
R2  value 10k  [SMD_0603_RES]  (hidden comment: ERJ-3EKF1002V)
R6  value 10m  Tolerance: 1%  [SMD_1206_RES]  (hidden comment: ERJ-8BWFR010V)
U9  BTS452RAKSA1  [FP-PG-TO252-5-MFG]
U16  INA226AQDGSRQ1  [TI-DGS0010A-VSSOP-10]

### Ports
EN, I2C (harness I2C), OUT, ST

### Nets
3V3: R2.2 U16.6(VS)
12V: R1.1 U9.6(VBB)
GND: D1.2(A) U9.1(GND) U16.1(A1) U16.2(A0) U16.7(GND)
Drive: U9.2(IN) ; port EN  [project net EN_OUT1]
Drive-St: R2.1 U9.4(ST) ; port ST  [project net ST_OUT1]
I2C.SCL: U16.5(SCL)
I2C.SDA: U16.4(SDA)
OUT: D1.1(C) R1.2 R6.1 R6.2 U9.5(OUT) U16.8(VBUS) U16.9(IN-) U16.10(IN+) ; port OUT  [project net Out1]

Not connected (* = marked no-connect by the designer): U16 3(ALERT)

### Buses and harness runs
harness I2C = port I2C

### Notes on the sheet
- (near U16) 0x80

### Library data of the parts
D1 = CMP-004-00025-A01: Vishay - 5A, 60V Schottky diode, DFN3820A, DO-220AA compatible; Forward Voltage: 430mV; RoHS Compliant: Yes; Pins: 2; Operating Temperature (Max): 175°C; Mounting Technology: SMD; Operating Temperature (Min): -40°C; Peak Reverse Voltage: 60V; Case/Package: DFN3820A; Forward Current: 5A
R1 R2 = CMP-009-07799-A10: as R?#1 on sheet ADC; Tolerance: 1%; Pins: 2; RoHS Compliant: Yes; Temperature Coefficient: ±100ppm/°C; Operating Temperature (Min): -55°C; Mounting Technology: SMT; Case/Package: 0603; Operating Temperature (Max): 125°C
R6 = CMP-009-10450-A07: as R5 on sheet Input Protection; Operating Temperature (Max): 125°C; Temperature Coefficient: ±200ppm/°C; Case/Package: 1206; Pins: 2; Mounting Technology: SMT; Operating Temperature (Min): -55°C; RoHS Compliant: Yes
U9 = CMP-00196-84309267-1: BTS452RAKSA1 Power Load Sw, High Side, -40 To 150Degc Rohs Compliant: Yes; Nominal Supply Current: 800µA; Min Supply Voltage: 6V; Number of Outputs: 1; Output Current: 1.8A; Max Supply Voltage: 52V; Max Power Dissipation: 41.6W; Max Junction Temperature (Tj): 150°C; NexarPartId: 84309267; Max Operating Temperature: 150°C; Min Operating Temperature: -40°C; Height: 2.5mm
U16 = CMP-015-00037-A01: as U12 on sheet EFuse_5V; Operating Temperature (Min): -40°C; Case/Package: VSSOP; Pins: 10; Supply Voltage (Max): 5.5V; Operating Temperature (Max): 125°C; RoHS Compliant: Yes; Mounting Technology: Surface Mount

## Sheet DTM13.SchDoc
size A4; SheetNumber: 11; SheetTotal: 14
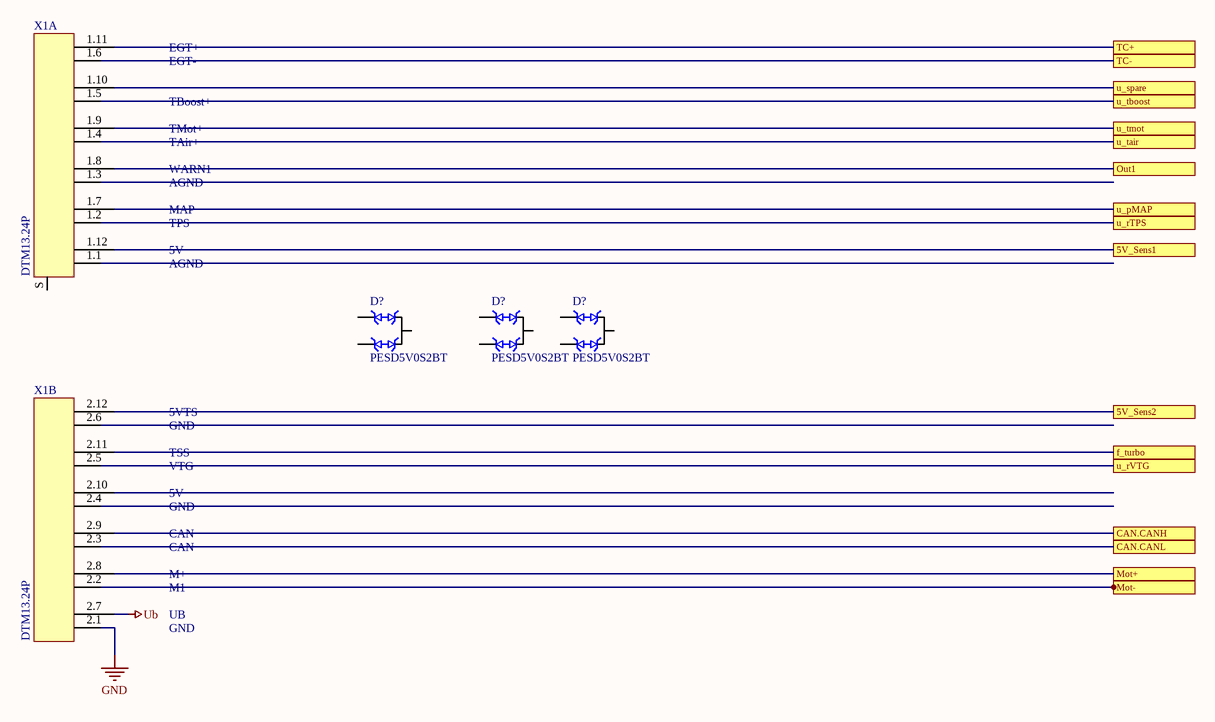
[diagram p10: DTM13.SchDoc]

### Parts
(Parts that share a designator on the sheet are numbered #1, #2 ... from top to bottom, then left to right.)
D?#1  PESD5V0S2BT  [ONSC-SOT-323-3-Generic]
D?#2  PESD5V0S2BT  [ONSC-SOT-323-3-Generic]
D?#3  PESD5V0S2BT  [ONSC-SOT-323-3-Generic]
X1  DTM13.24P  [DTM13-24P]  (parts A,B of 2)

### Ports
5V_Sens1, 5V_Sens2, CAN.CANH, CAN.CANL, f_turbo, Mot+, Mot-, Out1, TC+, TC-, u_pMAP, u_rTPS, u_rVTG, u_spare, u_tair, u_tboost, u_tmot

### Nets
GND: X1.2.1
Ub: X1.2.7
5V_Sens1: X1.1.12 ; port 5V_Sens1
5V_Sens2: X1.2.12 ; port 5V_Sens2
f_turbo: X1.2.11 ; port f_turbo
Mot-: X1.2.2 ; port Mot-
Out1: X1.1.8 ; port Out1
TC+: X1.1.11 ; port TC+
TC-: X1.1.6 ; port TC-
u_pMAP: X1.1.7 ; port u_pMAP
u_rTPS: X1.1.2 ; port u_rTPS
u_rVTG: X1.2.5 ; port u_rVTG
u_spare: X1.1.10 ; port u_spare
u_tboost: X1.1.5 ; port u_tboost
u_tmot: X1.1.9 ; port u_tmot
NetX1_1.4: X1.1.4 ; port u_tair
NetX1_2.3: X1.2.3 ; port CAN.CANL
NetX1_2.8: X1.2.8 ; port Mot+
NetX1_2.9: X1.2.9 ; port CAN.CANH

Not connected (* = marked no-connect by the designer): D?#1 1 2 3; D?#2 1 2 3; D?#3 1 2 3; X1 1.1 1.3 2.4 2.6 2.10 S

### Notes on the sheet
- EGT+
- EGT-
- TMot+
- TBoost+
- TAir+
- WARN1
- AGND
- 5V
- TPS
- MAP
- TSS
- VTG
- 5VTS
- GND
- CAN
- M+
- M1
- UB

### Library data of the parts
D?#1-D?#3 = CMP-004-00081-A01: TVS DIODE 5VWM 14VC SOT23 / ESD Suppressor Diode TVS Bi-Dir 5V Automotive 3-Pin SOT-23; Clamping Voltage (Max): 10V; Directionality: Bidirectional; Leakage Current (Max): 5nA; Breakdown Voltage (Min): 5.5V; Pins: 3; Case/Package: SOT-23; Standoff Voltage: 5V; Mounting Technology: SMT; RoHS Compliant: Yes; Operating Temperature (Min): -55°C; Operating Temperature (Max): 150°C
X1 = CMP-005-000001-3: Source: Deutsch.SchLib; Design Item ID: DTM13.24P; Pin Count: 25; Component Type: Standard

## Sheet Turbospeed.SchDoc
size A4; SheetNumber: 12; SheetTotal: 14; SPICEModelCacheAOEYIQHI: <root> / <DocumentId>AOEYIQHI</DocumentId> / <CacheFrame Number="0"> / <Model Name="0603_885012006042_470pf" Kind="CKT"> / <Text>******* / .subckt 0603_885012006042_470pF 1 2 / Rser 1 3 0.0647178553788 / Lser 2 4 3.67931779E-10 / C1 3 4 0.00000000047 / Rpar 3 4 10000000000 / .ends 0603_885012006042_470pF</Text> / </Model> / </CacheFrame> / </root>
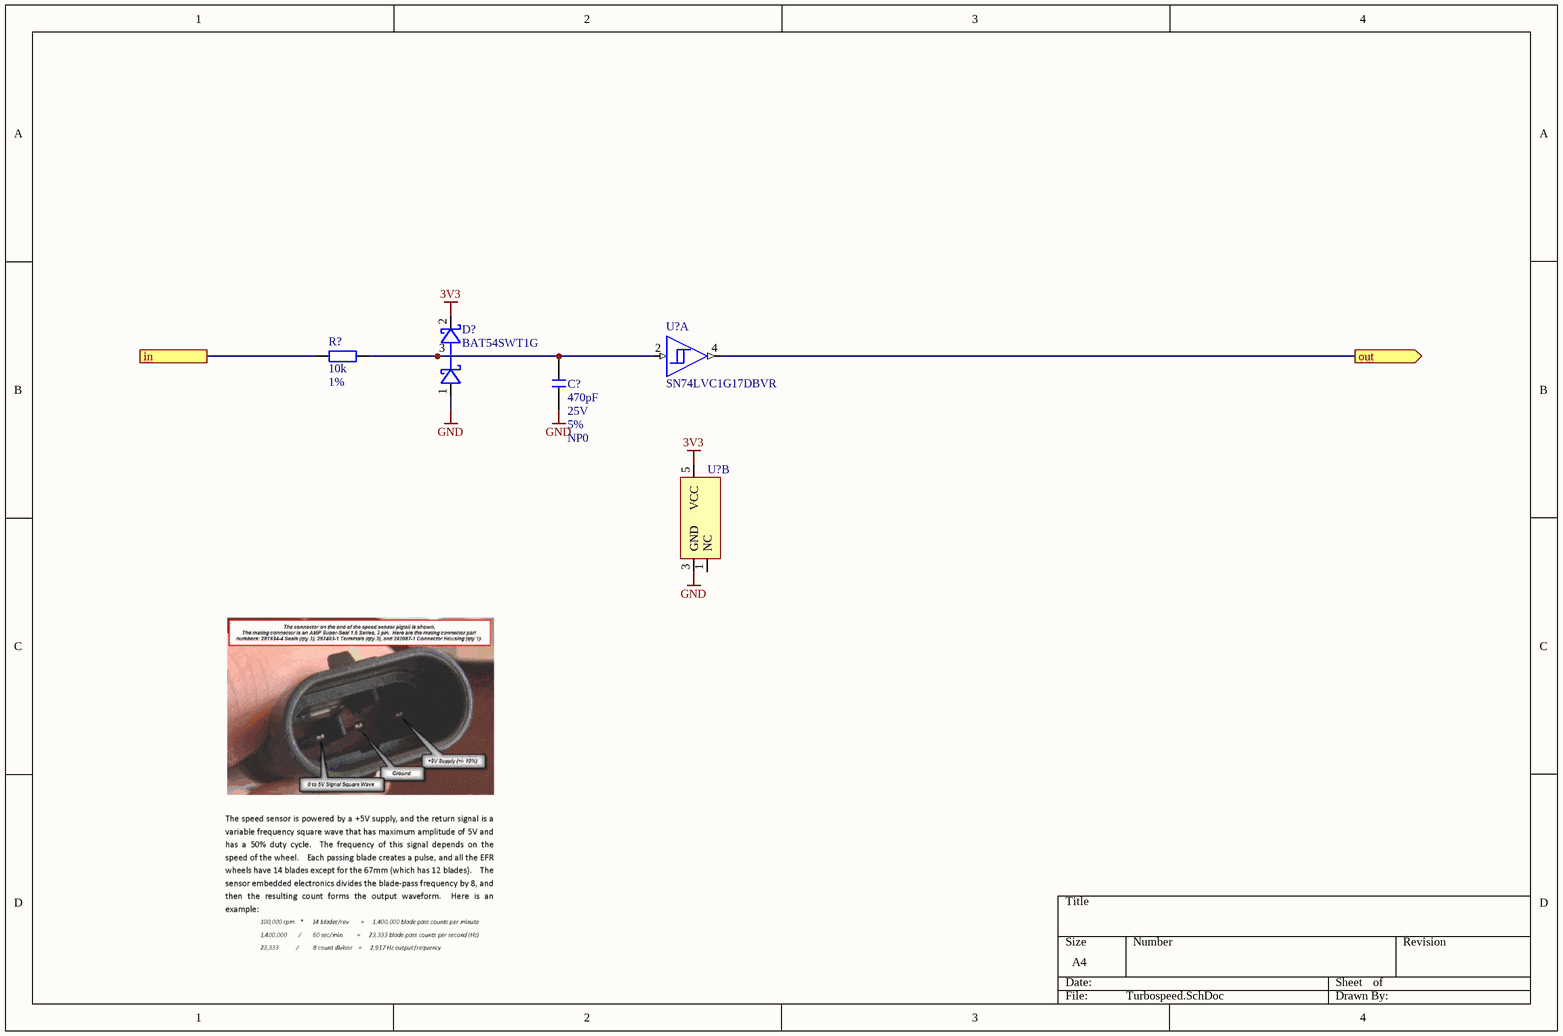
[diagram p11: Turbospeed.SchDoc]

### Parts
(Parts that share a designator on the sheet are numbered #1, #2 ... from top to bottom, then left to right.)
C?  value 470pF  Voltage Rating: 25V  Tolerance: 5%  Dielectric: NP0  [WCAP-CSGP_0603_L1.6W0.8H0.8_Reflow]  (hidden comment: 885012006042)
D?#4  BAT54SWT1G  [ONSC-SOT-323-3-Generic]
R?#4  value 10k  Tolerance: 1%  [SMD_0603_RES]  (hidden comment: ERJ-3EKF1002V)
U?#6  SN74LVC1G17DBVR  [TI-SOT23-5_DBV0005A]  (part A of 2)
U?#7  SN74LVC1G17DBVR  [TI-SOT23-5_DBV0005A]  (value not drawn)  (part B of 2)

### Ports
in (in), out (out)

### Nets
3V3: D?#4.2(K) U?#7.5(VCC)
GND: C?.1 D?#4.1(A) U?#7.3(GND)
NetC?_2: C?.2 D?#4.3(K/A) R?#4.2 U?#6.2(A)
NetU?#6_4: U?#6.4(Y) ; port out

Not connected (* = marked no-connect by the designer): R?#4 1; U?#7 1(NC)

### Library data of the parts
C? = CMP-001-00242-9: WCAP-CSGP Multilayer Ceramic Chip Capacitor, General Purpose, size 0603, NP0, 470pF, 25VDC; Capacitance Tolerance: +/-5%; Insulation Resistance: 10GO; Q Factor: 1000; Operating Temperature (Max): 125°C; Operating Temperature (Min): -55°C; Capacitor Type: Ceramic; Pins: 2; Mounting Technology: SMT; Case/Package: 0603
D?#4 = CMP-004-00031-7: Rectifier Diode, Schottky, 2 Element, 0.2A, 30V V(RRM), Silicon; Forward Current: 200mA; Forward Voltage: 220mV; Operating Temperature (Min): -55°C; Peak Reverse Voltage: 30V; Pins: 3; RoHS Compliant: Yes; Case/Package: SOT-323; Operating Temperature (Max): 125°C; Mounting Technology: SMD
R?#4 = CMP-009-07799-A10: as R?#1 on sheet ADC; Pins: 2; RoHS Compliant: Yes; Temperature Coefficient: ±100ppm/°C; Operating Temperature (Min): -55°C; Mounting Technology: SMT; Case/Package: 0603; Operating Temperature (Max): 125°C
U?#6 U?#7 = CMP-016-00026-A01: Single 1.65-V to 5.5-V buffer with Schmitt-Trigger inputs 5-SOT-23 -40 to 125; Supply Voltage (Max): 5.5V; Propagation Delay (Max): 5.5ns; Supply Voltage (Min): 1.8V; Logic Type: Buffer /w Schmitt Trigger; Operating Temperature (Max): 125°C; Pins: 5; Operating Temperature (Min): -55°C; Mounting Technology: Surface Mount; RoHS Compliant: Yes; Case/Package: SOT-23

## Sheet EFuse_12V.SchDoc
size A4; SheetNumber: 12; SheetTotal: 12
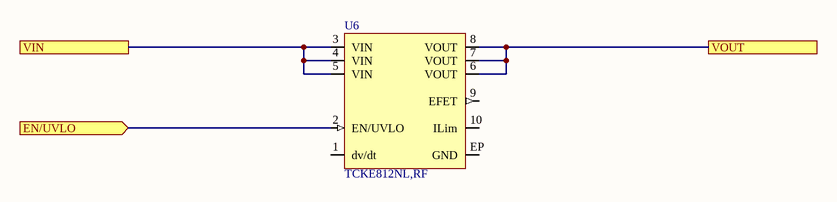
[diagram p12: EFuse_12V.SchDoc]

### Parts
U6  TCKE812NL,RF  [WSON10B-Toshiba]

### Ports
EN/UVLO (in), VIN, VOUT

### Nets
NetU6_2: U6.2(EN/UVLO) ; port EN/UVLO
NetU6_3: U6.3(VIN) U6.4(VIN) U6.5(VIN) ; port VIN
NetU6_6: U6.6(VOUT) U6.7(VOUT) U6.8(VOUT) ; port VOUT

Not connected (* = marked no-connect by the designer): U6 1(dv/dt) 9(EFET) 10(ILim) EP(GND)

### Library data of the parts
U6 = CMP-00024-00020-A01: Fuse IC with Adjustable Over Current Protection and Reverse Current Blocking FET Control; Supply Voltage (Min): 4.4V; Supply Voltage (Max): 18V; Source Current (Max): 5A; Case/Package: WSON10; Mounting Technology: SMT; Operating Temperature (Min): -55°C; Pins: 10; Operating Temperature (Max): 150°C; RoHS Compliant: Yes

## Nets that join several sheets
3V3: MCU (U4.5), ADC (U?#1.13 U?#2.13), EFuse_5V (U12.2 U12.6 U14.6), Input Protection (U15.6), HSS (R2.2 U16.6), Turbospeed (D?#4.2 U?#7.5)
5V: MCU (U4.3), ADC (U?#4.2), PSU_5V (U8.3)
12V: Input Protection (R5.2 U15.10), PSU_5V (U8.1), HSS (R1.1 U9.6)
+5V: ADC/LPF0 (U?_LPF15#2.5), ADC/LPF1 (U?_LPF1#2.5), ADC/LPF2 (U?_LPF2#2.5), ADC/LPF3 (U?_LPF3#2.5), ADC/LPF4 (U?_LPF4#2.5), ADC/LPF5 (U?_LPF5#2.5), ADC/LPF6 (U?_LPF6#2.5), ADC/LPF7 (U?_LPF7#2.5), ADC/LPF8 (U?_LPF8#2.5), ADC/LPF9 (U?_LPF9#2.5), ADC/LPF10 (U?_LPF10#2.5), ADC/LPF11 (U?_LPF11#2.5), ADC/LPF12 (U?_LPF12#2.5), ADC/LPF13 (U?_LPF13#2.5), ADC/LPF14 (U?_LPF14#2.5)
GND: MCU (U4.2 U4.8), ADC (5 pins), ADC/LPF0 (C?_LPF15#1.1 C?_LPF15#2.1 U?_LPF15#2.2), ADC/LPF1 (C?_LPF1#1.1 C?_LPF1#2.1 U?_LPF1#2.2), ADC/LPF2 (C?_LPF2#1.1 C?_LPF2#2.1 U?_LPF2#2.2), ADC/LPF3 (C?_LPF3#1.1 C?_LPF3#2.1 U?_LPF3#2.2), ADC/LPF4 (C?_LPF4#1.1 C?_LPF4#2.1 U?_LPF4#2.2), ADC/LPF5 (C?_LPF5#1.1 C?_LPF5#2.1 U?_LPF5#2.2), ADC/LPF6 (C?_LPF6#1.1 C?_LPF6#2.1 U?_LPF6#2.2), ADC/LPF7 (C?_LPF7#1.1 C?_LPF7#2.1 U?_LPF7#2.2), ADC/LPF8 (C?_LPF8#1.1 C?_LPF8#2.1 U?_LPF8#2.2), ADC/LPF9 (C?_LPF9#1.1 C?_LPF9#2.1 U?_LPF9#2.2), ADC/LPF10 (C?_LPF10#1.1 C?_LPF10#2.1 U?_LPF10#2.2), ADC/LPF11 (C?_LPF11#1.1 C?_LPF11#2.1 U?_LPF11#2.2), ADC/LPF12 (C?_LPF12#1.1 C?_LPF12#2.1 U?_LPF12#2.2), ADC/LPF13 (C?_LPF13#1.1 C?_LPF13#2.1 U?_LPF13#2.2), ADC/LPF14 (C?_LPF14#1.1 C?_LPF14#2.1 U?_LPF14#2.2), EFuse_5V (U12.1 U12.7 U14.1 U14.7), Input Protection (U7.7 U15.1 U15.7), PSU_5V (U8.2), HSS (5 pins), DTM13 (X1.2.1), Turbospeed (C?.1 D?#4.1 U?#7.3)
Ub: Input Protection (Q1.3), DTM13 (X1.2.7)
5V_Sens1: EFuse_5V (R3.2 U12.10), DTM13 (X1.1.12)
5V_Sens2: EFuse_5V (R4.2 U14.10), DTM13 (X1.2.12)
ADCIN0: ADC (U?#1.4), ADC/LPF0 (C?_LPF15#3.1 U?_LPF15#1.1 U?_LPF15#1.4)
ADCIN1: ADC (U?#1.5), ADC/LPF1 (C?_LPF1#3.1 U?_LPF1#1.1 U?_LPF1#1.4)
ADCIN2: ADC (U?#1.6), ADC/LPF2 (C?_LPF2#3.1 U?_LPF2#1.1 U?_LPF2#1.4)
ADCIN3: ADC (U?#1.7), ADC/LPF3 (C?_LPF3#3.1 U?_LPF3#1.1 U?_LPF3#1.4)
ADCIN4: ADC (U?#1.8), ADC/LPF4 (C?_LPF4#3.1 U?_LPF4#1.1 U?_LPF4#1.4)
ADCIN5: ADC (U?#1.9), ADC/LPF5 (C?_LPF5#3.1 U?_LPF5#1.1 U?_LPF5#1.4)
ADCIN6: ADC (U?#1.10), ADC/LPF6 (C?_LPF6#3.1 U?_LPF6#1.1 U?_LPF6#1.4)
ADCIN7: ADC (U?#1.11), ADC/LPF7 (C?_LPF7#3.1 U?_LPF7#1.1 U?_LPF7#1.4)
ADCIN8: ADC (U?#2.4), ADC/LPF8 (C?_LPF8#3.1 U?_LPF8#1.1 U?_LPF8#1.4)
ADCIN9: ADC (U?#2.5), ADC/LPF9 (C?_LPF9#3.1 U?_LPF9#1.1 U?_LPF9#1.4)
ADCIN10: ADC (U?#2.6), ADC/LPF10 (C?_LPF10#3.1 U?_LPF10#1.1 U?_LPF10#1.4)
ADCIN11: ADC (U?#2.7), ADC/LPF11 (C?_LPF11#3.1 U?_LPF11#1.1 U?_LPF11#1.4)
ADCIN12: ADC (U?#2.8), ADC/LPF12 (C?_LPF12#3.1 U?_LPF12#1.1 U?_LPF12#1.4)
ADCIN13: ADC (U?#2.9), ADC/LPF13 (C?_LPF13#3.1 U?_LPF13#1.1 U?_LPF13#1.4)
ADCIN14: ADC (U?#2.10), ADC/LPF14 (C?_LPF14#3.1 U?_LPF14#1.1 U?_LPF14#1.4)
Mot-: DRV8874 (U2.10), DTM13 (X1.2.2)
Out1: HSS (8 pins), DTM13 (X1.1.8)
TC+: VTG-Ctrl (J1.1), Max31856 (U1.4), DTM13 (X1.1.11)
TC-: Max31856 (U1.3), DTM13 (X1.1.6)
u_pMAP: ADC/LPF2 (R?_LPF2#1.1), DTM13 (X1.1.7)
u_rTPS: ADC/LPF1 (R?_LPF1#1.1), DTM13 (X1.1.2)
u_rVTG: ADC/LPF0 (R?_LPF15#1.1), DTM13 (X1.2.5)
u_spare: VTG-Ctrl (J1.2), ADC/LPF3 (R?_LPF3#1.1), DTM13 (X1.1.10)
u_tboost: ADC/LPF4 (R?_LPF4#1.1), DTM13 (X1.1.5)
u_tmot: ADC/LPF5 (R?_LPF5#1.1), DTM13 (X1.1.9)